# EAGLE design USBPowerBoost_TH_v0_1_4 (EAGLE 5.11)
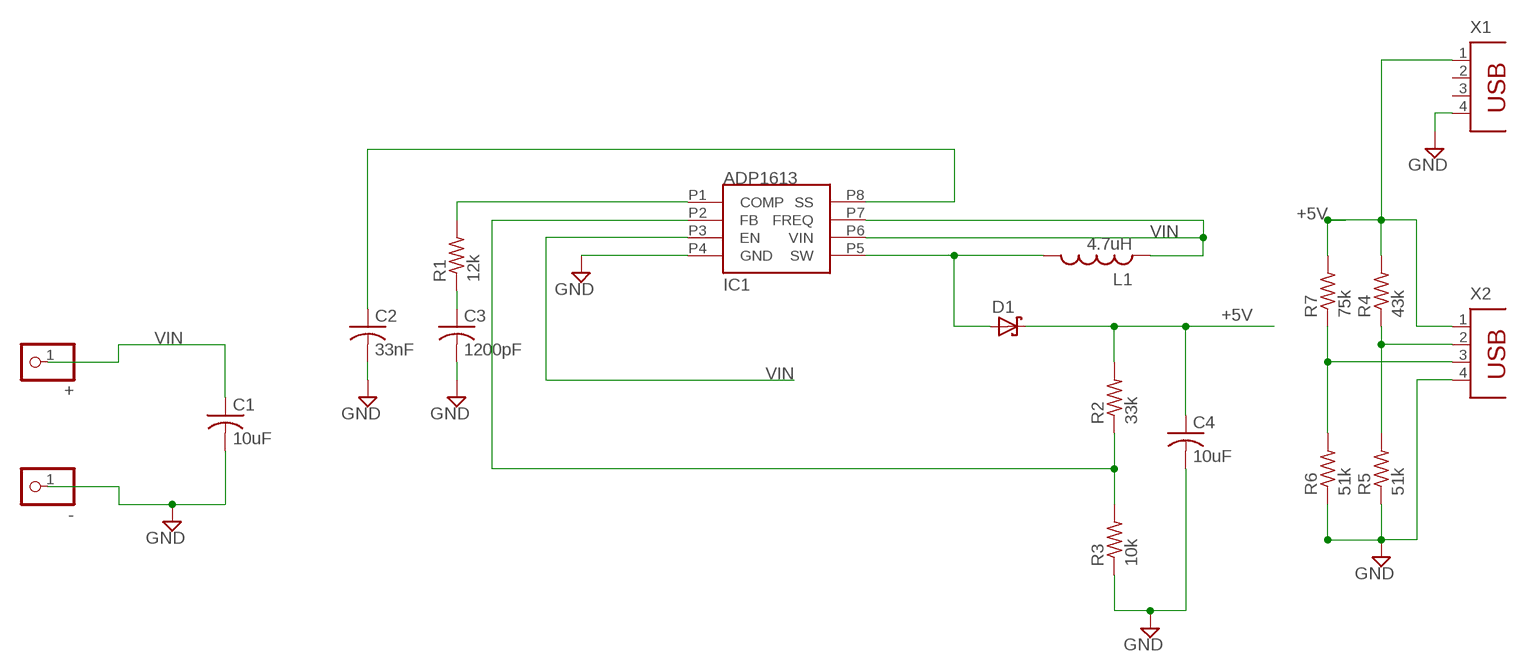
[diagram p0: schematic, sheet 1]

## Parts
+  PINHD-1X1  [1X01]
-  PINHD-1X1  [1X01]
C1  10uF  C-US025-025X050  [C025-025X050]
C2  33nF  C-US050-024X044  [C050-024X044]
C3  1200pF  C-US025-025X050  [C025-025X050]
C4  10uF  C-US025-025X050  [C025-025X050]
D1  SCHOTTKY-DIODE  [DIODE]
IC1  ADP1613  [RM-8]
L1  4.7uH  L-5MM-THRUHOLE  [L-5MM-THRUHOLE]
R1  12k  R-US_0204/5  [0204/5]
R2  33k  R-US_0204/5  [0204/5]
R3  10k  R-US_0204/5  [0204/5]
R4  43k  R-US_0204/5  [0204/5]
R5  51k  R-US_0204/5  [0204/5]
R6  51k  R-US_0204/5  [0204/5]
R7  75k  R-US_0204/5  [0204/5]
X1  PN87520  [PN87520]
X2  PN87520  [PN87520]

## Nets
5V: D1.ANNODE(A) IC1.P5(SW) L1.2
+5V: C4.1 D1.CATHODE(C) R2.2 R4.2 R7.2 X1.1 X2.1
GND: -.1 C1.2 C2.2 C3.2 C4.2 IC1.P4(GND) R3.1 R5.1 R6.1 X1.4 X2.4
N$2: IC1.P2(FB) R2.1 R3.2
N$3: R4.1 R5.2 X2.2
N$5: IC1.P1(COMP) R1.2
N$7: C3.1 R1.1
N$11: C2.1 IC1.P8(SS)
N$15: R6.2 R7.1 X2.3
VIN: +.1 C1.1 IC1.P3(EN) IC1.P6(VIN) IC1.P7(FREQ) L1.1
Unconnected: X1.2 X1.3

## Library data of the parts
+ - = pinhead:PINHD-1X1: PIN HEADER
C1-C4 = resistor:C-US: CAPACITOR, American symbol
D1 = bootstrapsolar:SCHOTTKY-DIODE: Schottky diode. 1N5820 to 1N5822. 1.4mm holes spaced 12mm apart.
IC1 = adp1613:ADP1613
L1 = bootstrapsolar:L-5MM-THRUHOLE: Inductor, thru hole. 5mm between pins, 9mm radius.
R1-R7 = adafruit:R-US_: RESISTOR, American symbol
X1 X2 = con-berg:PN87520: BERG USB connector; OC_FARNELL: unknown; OC_NEWARK: unknown

## Board
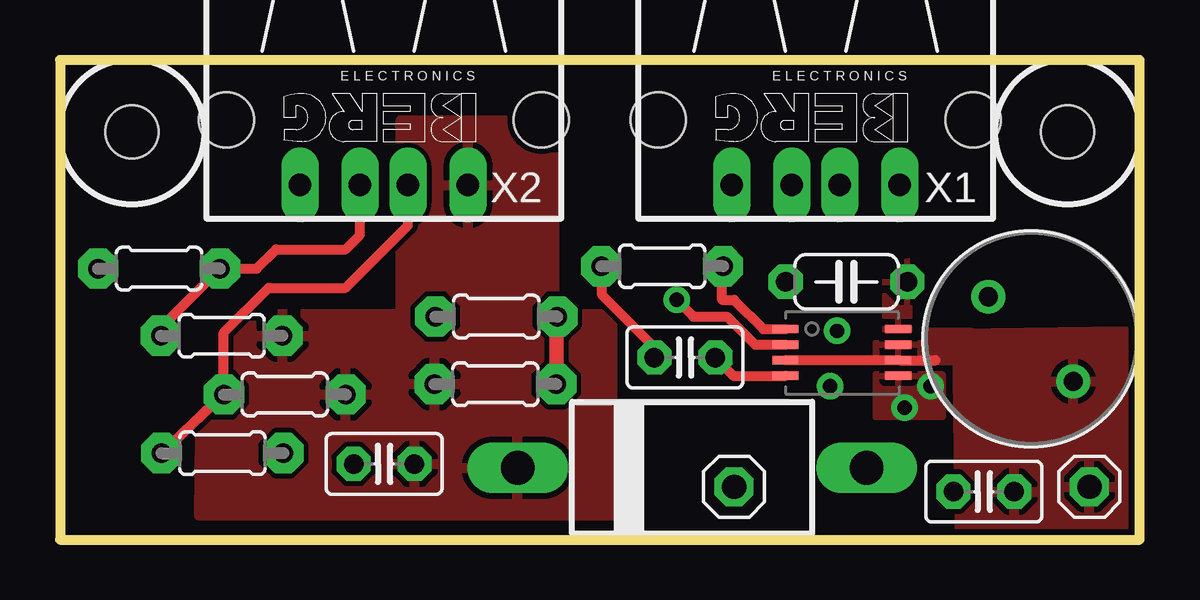
[diagram p1: board, top side]
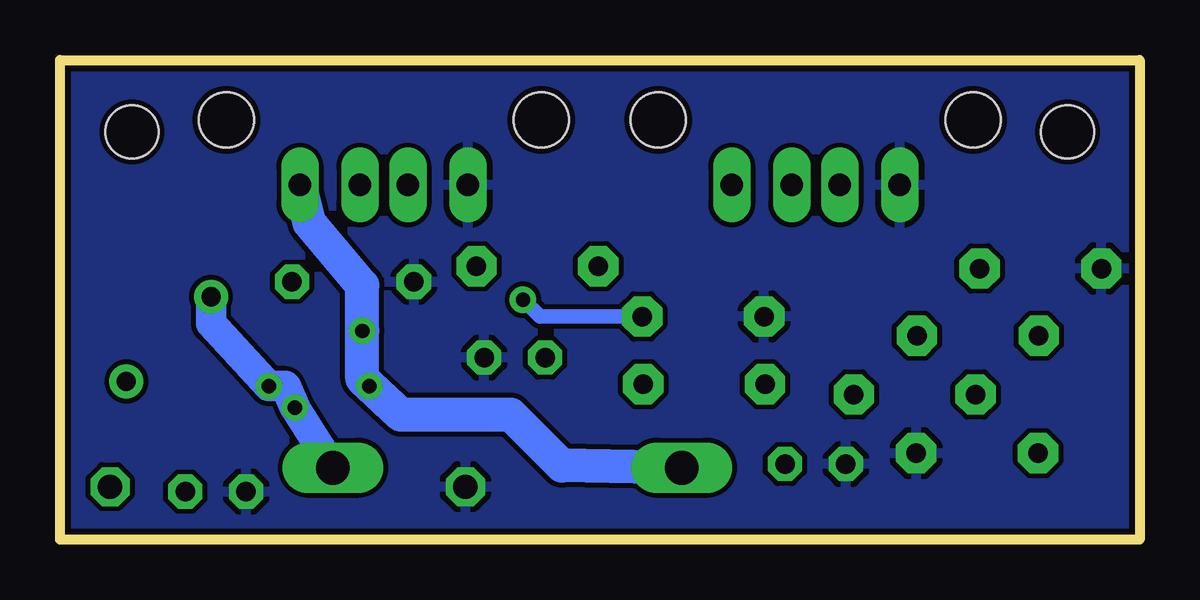
[diagram p2: board, bottom side, seen from below]

Size 45 x 20 mm. Coordinates in mm from the lower left corner, seen from the top.
Outline: 0,0 45,0 45,20 0,20 0,0
Copper layers (1*16): Top 0.035mm / dielectric 1.5mm / Bottom 0.035mm
Design rules "SparkFun": minimum track width 8mil, minimum drill 20mil, track to track 8mil, track to pad 8mil, pad to pad 8mil, via to via 8mil, smd to smd 8mil, copper to edge 10mil, drill to drill 8mil, minimum pad ring 12mil, minimum via ring 10mil, stop-mask expansion 4mil, vias tented up to drill 25mil, thermal gap 10mil
Holes 2.2 mm at 3,17 42,17

### Footprints (pad centres in the part's own frame; a part is rotated, then mirrored left to right if it is on the bottom)
1X01 = drill 1.016 octagon: 1 0,0
C025-025X050 = drill 0.813 octagon: 1 -1.27,0; 2 1.27,0
C050-024X044 = drill 0.813 octagon: 1 -2.54,0; 2 2.54,0
DIODE = drill 1.4 long: ANNODE -7.27,0; CATHODE 7.27,0
RM-8 = smd 1.1 x 0.35: P1 -4.7,0.7; P2 -4.7,0.05; P3 -4.7,-0.6; P4 -4.7,-1.25; P5 0,-1.25; P6 0,-0.6; P7 0,0.05; P8 0,0.7
L-5MM-THRUHOLE = drill 0.8 round: 1 -2.5,0; 2 2.5,0
0204/5 = drill 0.813 pad 1.676 octagon: 1 -2.54,0; 2 2.54,0
PN87520 = drill 0.95 long: 1 -3.5,2.71; 2 -1,2.71; 3 1,2.71; 4 3.5,2.71 | hole 2.3: -6.57,0; 6.57,0

### Placement (x,y rotation side)
+  42.91,2.2 0 top
-  28.1,2.2 0 top
C1  38.51,2 180 top
C2  32.79,10.75 180 top
C3  26.05,7.59 0 top
C4  13.51,3.15 180 top
D1  26.35,2.99 180 top
IC1  34.94,8.08 0 top
L1  40.47,8.36 135 top
R1  25.1,11.4 0 top
R2  18.15,6.48 180 top
R3  18.19,9.3 0 top
R4  9.37,6.05 0 top
R5  6.77,3.6 180 top
R6  4.13,11.3 0 top
R7  6.74,8.5 0 top
X1  31.5,17.5 180 top
X2  13.5,17.5 180 top

### Tracks (layer width: path | path; a pad name or v marks a point on that pad's centre or on a via)
5V  (via drill 0.6)
  Bottom 1.27: D1.ANNODE 34.15,3.85 v35.2,5.5 35.6,6.4 v36.3,6.4 38.7,9 L1.2
  pour Top: 34,6.9 36.8,6.9 36.8,5.1 34,5.1
+5V  (via drill 0.6)
  Bottom 0.406: v32.1,6.4 32.4,6.4 32.4,6.8
  Bottom 1.422: D1.CATHODE 24.09,3.09 26.2,5.2 30.8,5.2 32.4,6.7 32.4,6.8 v32.4,8.7 32.4,10.6 34.6,13.2 X1.1
  pour Top: 14.2,17.5 20.6,17.5 20.6,8.1 14.2,8.1
  pour Top: 5.9,9.4 23,9.4 23,1 5.8,1
GND
  Top 0.406: IC1.P4 28.08,6.83 C3.2
  pour Bottom: -0.5,20.5 45.25,20.5 45.25,-0.5 -0.5,-0.5
N$2  (via drill 0.6)
  Top 0.406: IC1.P2 28.97,8.13 27.8,9.3 26.4,9.3 v25.7,10
  Top 0.61: R2.1 20.69,8.86 R3.2
  Bottom 0.61: R3.2 25,9.3 v25.7,10
N$3
  Top 0.406: R5.2 R4.1 6.83,8.63 8.7,10.5 11.9,10.5 14.5,13.1 X2.2 | X2.2 14.5,15.5 14.4,15.6 14.4,14.89 X2.2
N$5
  Top 0.406: IC1.P1 29.32,8.78 28.1,10 27.6,10 27.6,11.36 R1.2
N$7
  Top 0.406: C3.1 24.78,8.02 22.6,10.2 22.6,11.36 R1.1
N$11
  pour Top: 35.4,8.7 34.4,8.7 34.4,11.6 35.4,11.6
N$15
  Top 0.406: X2.3 12.5,12.7 11.9,12.1 9,12.1 8.2,11.3 R6.2 4.2,8.83 R7.1
VIN
  Top 0.254: IC1.P6 35,7.48 35,7.47
  Top 0.406: 35,7.47 36.5,7.47 | IC1.P3 IC1.P6
  pour Top: 36.2,7.4 38,7.4 38,8.7 36.2,8.7
  pour Top: 37.4,8.6 44.4,8.7 44.5,0.4 37.5,0.3
  pour Top: 34,8.2 37.1,8.2 37.1,7.4 34,7.4

### Text on the board
tDocu: i-devices | USB 5V | BootstrapSolar.com
bDocu: Bootstrap | Booster-TH | Solar.com